# EAGLE board NTC_MUX8_board (EAGLE 9.6.2), part 1 of 2
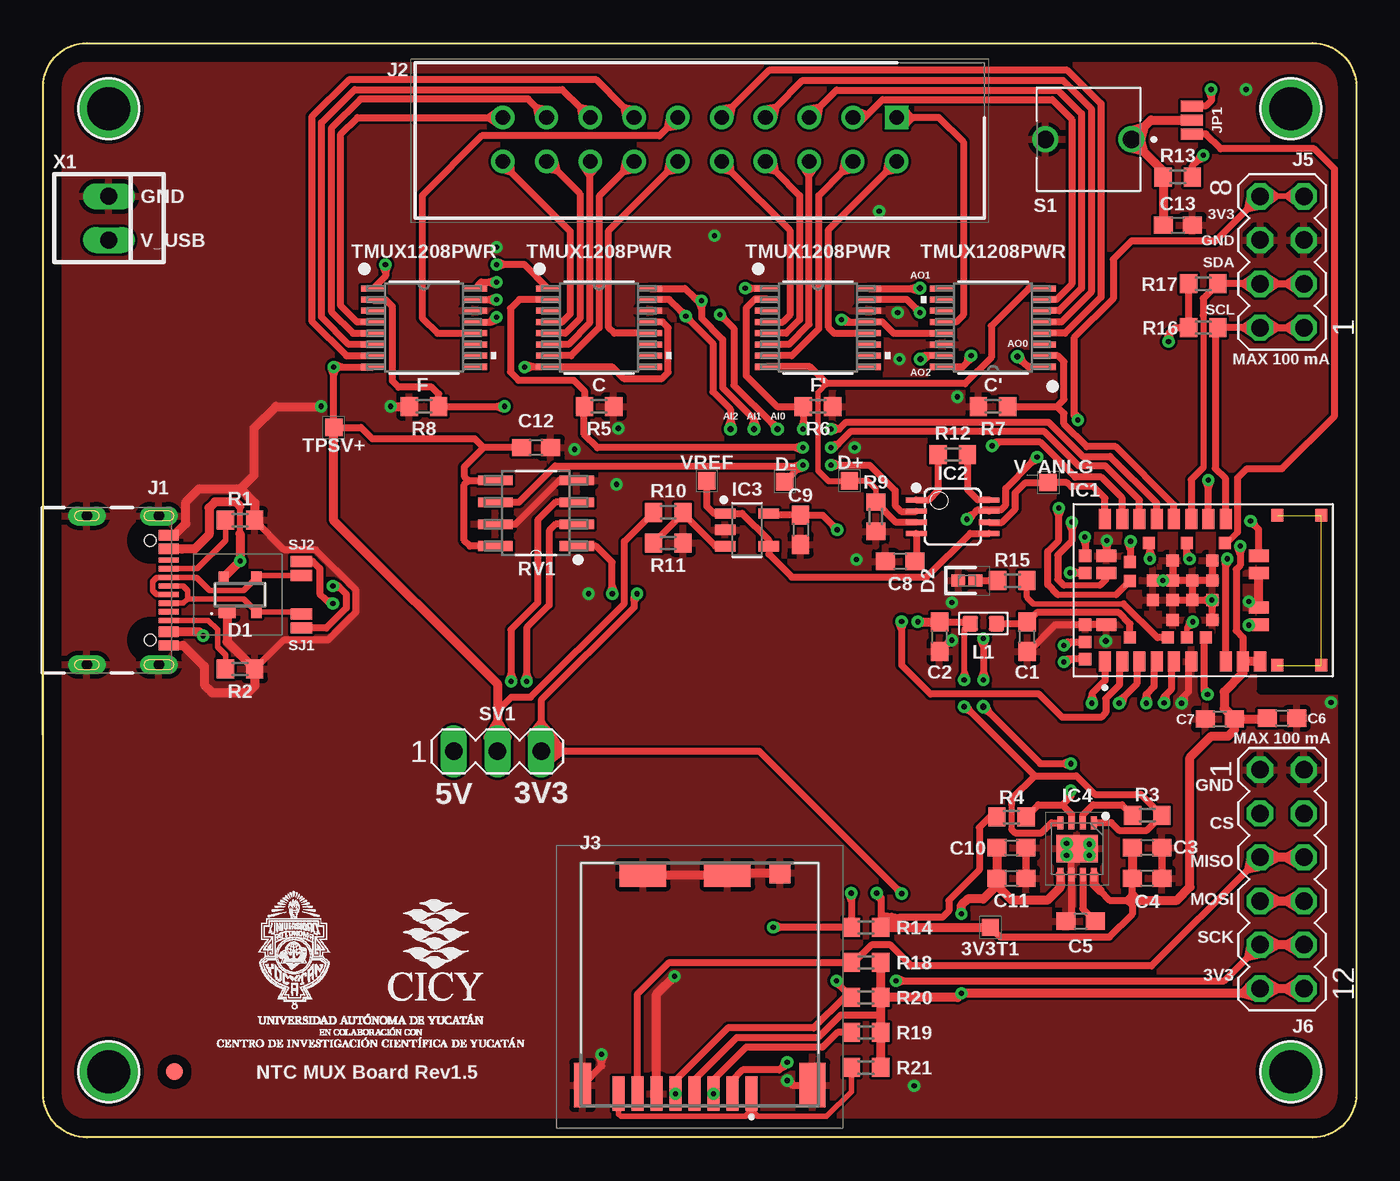
[diagram p1: board, top side]
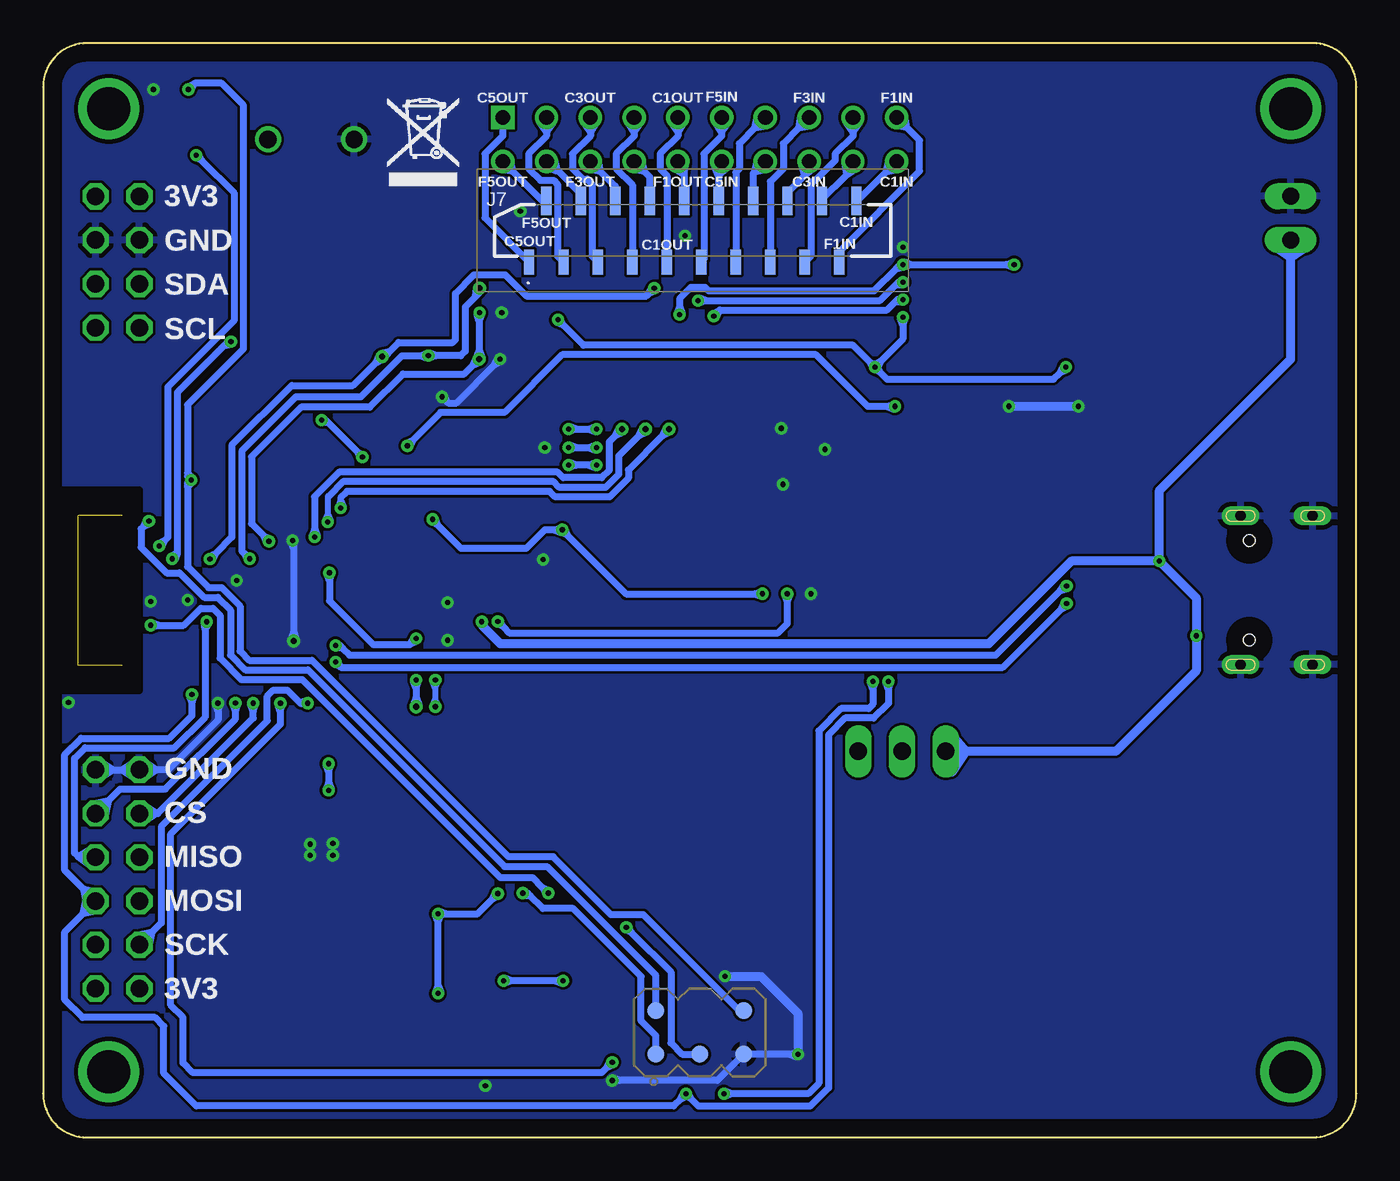
[diagram p2: board, bottom side, seen from below]

Size 76.2 x 63.5 mm. Coordinates in mm from the lower left corner, seen from the top.
Outline: 0,2.54 0,60.96 arc-90 2.54,63.5 73.66,63.5 arc-90 76.2,60.96 76.2,2.54 arc-90 73.66,0 2.54,0 arc-90 0,2.54
Copper layers (1*16): Top 0.035mm / dielectric 1.5mm / Bottom 0.035mm
Design rules "default *": minimum track width 6mil, minimum drill 0.35mm, track to track 6mil, track to pad 6mil, pad to pad 6mil, via to via 6mil, smd to smd 6mil, copper to edge 40mil, drill to drill 6mil, minimum pad ring 10mil, minimum via ring 8mil, stop-mask expansion 4mil, vias tented up to drill 13mil, thermal gap 10mil

## Footprints (pad centres in the part's own frame; a part is rotated, then mirrored left to right if it is on the bottom)
TESTPOINT_SMD-10SN = smd 1 x 1: TP 0,0
C0603 = smd 1.1 x 1: 1 -0.85,0; 2 0.85,0
PRTR5V0U2X = smd 1 x 0.7: 1 -0.75,-1 | smd 0.6 x 0.7: 2 0.95,-1; 3 0.95,1; 4 -0.95,1
LEDC1006X25N = smd 0.8 x 0.7: 1 -0.5,0; 2 0.5,0
FIDUCIAL_1MM = smd 1 x 1: 1 0,0
XCVR_NINA-B306-00B-00 = smd 1.15 x 0.7: 1 -4.125,5.7; 2 -4.125,4.7; 3 -4.125,3.7; 4 -4.125,2.7; 5 -4.125,1.7; 6 -4.125,0.7; 8 -4.125,-1.3; 9 -4.125,-2.3; 10 -4.125,-3.3; 18 4.125,-1.3; 19 4.125,-0.3; 20 4.125,0.7; 21 4.125,1.7; 22 4.125,2.7; 23 4.125,3.7; 24 4.125,4.7; 25 4.125,5.7 | smd 0.7 x 1.15: 11 -2,-3.225; 12 -1,-3.225; 14 1,-3.225; 15 2,-3.225; 26 2,5.625; 27 1,5.625; 30 -2,5.625 | smd 0.7 x 0.7: 31 -2.75,4.25; 33 -2.75,2.05; 34 -2.75,0.95; 35 -2.75,-0.15; 37 2.75,-1.25; 39 2.75,0.95; 41 2.75,3.15; 43 1.65,4.25; 44 0.55,4.25; 49 2,6.85; 50 1,6.85; 53 -2,6.85; 54 -3,6.85; 55 -4,6.85; EAGP1 -4.35,-4.3; EAGP2 4.35,-4.3; EAGP3 -4.35,-6.85; EAGP4 4.35,-6.85; EGP1 -0.575,2.925; EGP2 0.575,2.925; EGP3 -1.725,1.775; EGP4 -0.575,1.775; EGP5 0.575,1.775; EGP6 1.725,1.775; EGP7 -0.575,0.625; EGP8 0.575,0.625; EGP9 -1.725,-0.525; EGP10 -0.575,-0.525; EGP11 0.575,-0.525; EGP12 1.725,-0.525
MSOP08 = smd 0.3 x 1.2: 1 -0.976,-2.113; 2 -0.326,-2.113; 3 0.324,-2.113; 4 0.974,-2.113; 5 0.974,2.112; 6 0.324,2.112; 7 -0.326,2.112; 8 -0.976,2.112
SOT95P280X145-5N = smd 1.186 x 0.597: 1 -1.264,0.95; 2 -1.264,0; 3 -1.264,-0.95; 4 1.264,-0.95; 5 1.264,0.95
SON65P300X300X80-9N = smd 0.75 x 0.35: 1 -1.5,0.975; 2 -1.5,0.325; 3 -1.5,-0.325; 4 -1.5,-0.975; 5 1.5,-0.975; 6 1.5,-0.325; 7 1.5,0.325; 8 1.5,0.975 | smd 1.6 x 2.4: 9 0,0
GCT_USB4105-GF-A = smd 0.6 x 1.15: A1_B12 -3.2,4.755; A4_B9 -2.4,4.755; B1_A12 3.2,4.755; B4_A9 2.4,4.755 | smd 0.3 x 1.15: A5 -1.25,4.755; A6 -0.25,4.755; A7 0.25,4.755; A8 1.25,4.755; B5 1.75,4.755; B6 0.75,4.755; B7 -0.75,4.755; B8 -1.75,4.755 | drill 0.6 pad 1.05 long: S1 -4.32,4.18; S4 4.32,4.18 | drill 0.6 pad 1 long: S2 -4.32,0; S3 4.32,0 | hole 0.65: 2.89,3.68; -2.89,3.68
SHDR20W66P254_2X10_3302X883X92 = drill 0.85 pad 1.275 square: 1 0,0 | drill 0.85 pad 1.275: 2 0,2.54; 3 2.54,0; 4 2.54,2.54; 5 5.08,0; 6 5.08,2.54; 7 7.62,0; 8 7.62,2.54; 9 10.16,0; 10 10.16,2.54; 11 12.7,0; 12 12.7,2.54; 13 15.24,0; 14 15.24,2.54; 15 17.78,0; 16 17.78,2.54; 17 20.32,0; 18 20.32,2.54; 19 22.86,0; 20 22.86,2.54
DM3CSSFPEJMS = smd 0.7 x 2: 1 3,-6.35; 2 1.9,-6.35; 3 0.8,-6.35; 4 -0.3,-6.35; 5 -1.4,-6.35; 6 -2.5,-6.35; 7 -3.6,-6.35; 8 -4.7,-6.35 | smd 1 x 2.6: 9 -6.8,-5.85 | smd 1.5 x 2.6: 10 6.55,-5.85 | smd 1.2 x 1.2: 11 4.65,6.45 | smd 2.7 x 1.4: 12 1.6,6.35; 13 -3.3,6.35
2X03-TP1 = smd 1 x 1 bottom: 1 -2.54,1.27; 2 -2.54,-1.27; 3 0,1.27; 5 2.54,1.27; 6 2.54,-1.27
MA04-2 = drill 1.016 octagon: 1 -3.81,-1.27; 2 -3.81,1.27; 3 -1.27,-1.27; 4 -1.27,1.27; 5 1.27,-1.27; 6 1.27,1.27; 7 3.81,-1.27; 8 3.81,1.27
MA06-2 = drill 1.016 octagon: 1 -6.35,-1.27; 2 -6.35,1.27; 3 -3.81,-1.27; 4 -3.81,1.27; 5 -1.27,-1.27; 6 -1.27,1.27; 7 1.27,-1.27; 8 1.27,1.27; 9 3.81,-1.27; 10 3.81,1.27; 11 6.35,-1.27; 12 6.35,1.27
528082071 = smd 0.6 x 1.45: 1 -9.5,-1.775; 3 -7.5,-1.775; 5 -5.5,-1.775; 7 -3.5,-1.775; 9 -1.5,-1.775; 11 0.5,-1.775; 13 2.5,-1.775; 15 4.5,-1.775; 17 6.5,-1.775; 19 8.5,-1.775 | smd 0.6 x 1.65: 2 -8.5,1.775; 4 -6.5,1.775; 6 -4.5,1.775; 8 -2.5,1.775; 10 -0.5,1.775; 12 1.5,1.775; 14 3.5,1.775; 16 5.5,1.775; 18 7.5,1.775; 20 9.5,1.775
SMT-JUMPER_3_NO_NO-SILK = smd 0.635 x 1.27: 1 -0.813,0; 2 0,0; 3 0.813,0
L0603 = smd 0.889 x 0.889: 1 -0.762,0; 2 0.762,0
R0603 = smd 1 x 1.1: 1 -0.85,0; 2 0.85,0
SOIC127P600X175-8N = smd 1.981 x 0.559: 1 -2.362,1.905; 2 -2.362,0.635; 3 -2.362,-0.635; 4 -2.362,-1.905; 5 2.362,-1.905; 6 2.362,-0.635; 7 2.362,0.635; 8 2.362,1.905
SW_BUTT-2 = drill 1: 1 -2.5,0; 2 2.5,0
SMT-JUMPER_2_NO_NO-SILK = smd 0.635 x 1.27: 1 -0.406,0; 2 0.406,0
MA03-1 = drill 1.016 long: 1 -2.54,0; 2 0,0; 3 2.54,0
PW_16_TEX = smd 1.406 x 0.351: 1 -2.953,2.275; 2 -2.953,1.625; 3 -2.953,0.975; 4 -2.953,0.325; 5 -2.953,-0.325; 6 -2.953,-0.975; 7 -2.953,-1.625; 8 -2.953,-2.275; 9 2.953,-2.275; 10 2.953,-1.625; 11 2.953,-0.975; 12 2.953,-0.325; 13 2.953,0.325; 14 2.953,0.975; 15 2.953,1.625; 16 2.953,2.275
MOUNTINGHOLE_2.5_PLATED = drill 2.5 pad 3.2: P$1 0,0
22-23-2021 = drill 1 long: 1 -1.27,0; 2 1.27,0

## Placement (x,y rotation side)
3V3T1  TESTPOINT_TPS-SMD-10SN  [TESTPOINT_SMD-10SN]  54.97,12.19 180 top
C1  1n  [C0603]  57.1,29.06 90 top
C2  1n  [C0603]  52.02,29.06 90 top
C3  100nF  [C0603]  64.06,16.81 180 top
C4  10uF  [C0603]  64.06,15.04 180 top
C5  0.01uF  [C0603]  60.2,12.55 180 top
C6  100nF  [C0603]  71.88,24.33 0 top
C7  100nF  [C0603]  68.28,24.28 180 top
C8  0.1uF  [C0603]  49.73,33.43 180 top
C9  2.2uF  [C0603]  43.94,35.26 270 top
C10  100nF  [C0603]  56.18,16.81 0 top
C11  10uF  [C0603]  56.18,15.04 0 top
C12  2.2uF  [C0603]  28.6,40.03 0 top
C13  0.1 uF  [C0603]  65.84,52.93 0 top
D1  PRTR5V0U2X  [PRTR5V0U2X]  11.43,31.5 0 top
D2  SML-P12PTT86R  [LEDC1006X25N]  53.59,32.31 0 top
D+  TESTPOINT_TPS-SMD-10SN  [TESTPOINT_SMD-10SN]  46.79,38.1 0 top
D-  TESTPOINT_TPS-SMD-10SN  [TESTPOINT_SMD-10SN]  43.03,38.05 0 top
FID1  FIDUCIAL_1MM  [FIDUCIAL_1MM]  7.62,3.81 0 top
IC1  NINA-B306-00B-00  [XCVR_NINA-B306-00B-00]  67.31,31.75 90 top
IC2  INA126E  [MSOP08]  52.78,36.02 270 top
IC3  MCP6001T_SOT23  [SOT95P280X145-5N]  40.84,35.26 0 top
IC4  MAX8559ETAAA+T  [SON65P300X300X80-9N]  59.99,16.76 270 top
J1  USB4105-GF-A  [GCT_USB4105-GF-A]  2.54,31.75 270 top
J2  1761681-7  [SHDR20W66P254_2X10_3302X883X92]  49.53,59.18 180 top
J3  DM3CS-SF-PEJMS  [DM3CSSFPEJMS]  38.1,8.89 0 top
J4  DNP  [2X03-TP1]  38.1,6.1 180 top
J5  [MA04-2]  71.88,50.8 90 top
J6  [MA06-2]  71.88,14.99 270 top
J7  52808-2071  [528082071]  38.51,52.58 0 bottom
JP1  JUMPER-SMT_3_NO_NO-SILK  [SMT-JUMPER_3_NO_NO-SILK]  66.65,59.03 270 top
L1  2500R-50MA  [L0603]  54.56,29.82 0 top
R1  5.1k  [R0603]  11.43,35.81 180 top
R2  5.1k  [R0603]  11.43,27.18 180 top
R3  1k  [R0603]  64.06,18.69 180 top
R4  1k  [R0603]  56.18,18.59 0 top
R5  1k  [R0603]  32.26,42.42 180 top
R6  1k  [R0603]  44.96,42.42 180 top
R7  1k  [R0603]  55.12,42.42 0 top
R8  1k  [R0603]  22.1,42.42 0 top
R9  220k  [R0603]  48.31,36.02 90 top
R10  100k  [R0603]  36.27,36.27 0 top
R11  100k  [R0603]  36.27,34.49 0 top
R12  1.7k  [R0603]  52.78,39.62 180 top
R13  DNP  [R0603]  65.84,55.73 0 top
R14  DNP  [R0603]  47.75,12.19 180 top
R15  1k  [R0603]  56.24,32.31 0 top
R16  4k7  [R0603]  67.31,46.99 0 top
R17  4k7  [R0603]  67.31,49.53 0 top
R18  10k  [R0603]  47.75,10.16 0 top
R19  10k  [R0603]  47.75,6.1 0 top
R20  10k  [R0603]  47.75,8.13 0 top
R21  10k  [R0603]  47.75,4.06 0 top
RV1  MCP41010T-I/SN  [SOIC127P600X175-8N]  28.6,36.22 180 top
S1  BUTT-2  [SW_BUTT-2]  60.66,57.91 180 top
SJ1  JUMPER-SMT_2_NO_NO-SILK  [SMT-JUMPER_2_NO_NO-SILK]  14.99,29.97 270 top
SJ2  JUMPER-SMT_2_NO_NO-SILK  [SMT-JUMPER_2_NO_NO-SILK]  14.99,33.02 90 top
SV1  [MA03-1]  26.37,22.4 0 top
TPSV+  TESTPOINT_TPS-SMD-10SN  [TESTPOINT_SMD-10SN]  16.87,41.2 180 top
U1  TMUX1208PWR  [PW_16_TEX]  22.1,46.99 0 top
U2  TMUX1208PWR  [PW_16_TEX]  32.26,46.99 0 top
U3  TMUX1208PWR  [PW_16_TEX]  44.96,46.99 0 top
U4  TMUX1208PWR  [PW_16_TEX]  55.12,46.99 180 top
U$2  MOUNTINGHOLE2.5  [MOUNTINGHOLE_2.5_PLATED]  72.39,3.81 0 top
U$3  MOUNTINGHOLE2.5  [MOUNTINGHOLE_2.5_PLATED]  72.39,59.69 0 top
U$4  MOUNTINGHOLE2.5  [MOUNTINGHOLE_2.5_PLATED]  3.81,59.69 0 top
U$5  [UADY-CICY-MID]  9.91,4.57 0 top
U$24  MOUNTINGHOLE2.5  [MOUNTINGHOLE_2.5_PLATED]  3.81,3.81 0 top
V_ANLG  TESTPOINT_TPS-SMD-10SN  [TESTPOINT_SMD-10SN]  58.32,38 0 top
VREF  TESTPOINT_TPS-SMD-10SN  [TESTPOINT_SMD-10SN]  38.51,38.1 0 top
X1  22-23-2021  [22-23-2021]  3.81,53.34 270 top